# Altium schematic sheet tmtr_board_rev1_0.SchDoc: tmtr_board_rev1.sch
size 282 x 200 mm; Date: 12/27/2014 6:12:07 PM; SheetNumber: Sheet:
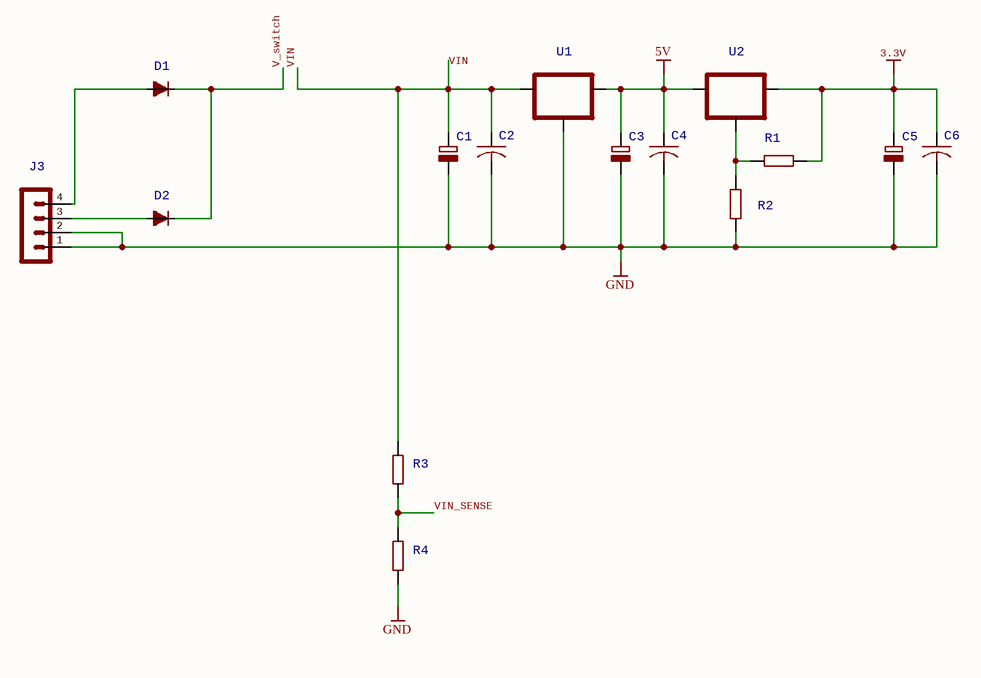
[diagram p0: tmtr_board_rev1_0.SchDoc]

## Parts
C1  <B>POLARIZED CAPACITOR</B>, European symbol  [153CLV-0810]  (value not drawn)
C2  <B>CAPACITOR</B>, American symbol  [C0805K]  (value not drawn)
C3  <B>POLARIZED CAPACITOR</B>, European symbol  [153CLV-0810]  (value not drawn)
C4  <B>CAPACITOR</B>, American symbol  [C0805K]  (value not drawn)
C5  <B>POLARIZED CAPACITOR</B>, European symbol  [153CLV-0810]  (value not drawn)
C6  <B>CAPACITOR</B>, American symbol  [C0805K]  (value not drawn)
D1  D-FILL-SMB  [SMB]  (value not drawn)
D2  D-FILL-SMB  [SMB]  (value not drawn)
J3  MA04-1  [MA04-1]  (value not drawn)
R1  R-EU_M0805  [M0805]  (value not drawn)
R2  R-EU_M0805  [M0805]  (value not drawn)
R3  R-EU_M0805  [M0805]  (value not drawn)
R4  R-EU_M0805  [M0805]  (value not drawn)
U1  78XXS  [78XXS]  (value not drawn)
U2  LD117A?*S  [SOT223]  (value not drawn)

## Nets
3.3V: C5.+ C6.1 R1.2 U2.4(OUT)
5V: C3.+ C4.1 U1.OUT U2.3(IN)
GND: C1.- C2.2 C3.- C4.2 C5.- C6.2 J3.1 J3.2 R2.2 R4.2 U1.GND
V_switch: D1.1(C) D2.1(C)
VIN: C1.+ C2.1 R3.1 U1.IN
VIN_SENSE: R3.2 R4.1
NetD1_2: D1.2(A) J3.4
NetD2_2: D2.2(A) J3.3
NetR1_1: R1.1 R2.1 U2.1(ADJ)

## Notes on the sheet
- 1
- 2
- 3
- 4
- 5
- 6
- A
- B
- C
- D

## Library data of the parts
C1 C3 C5 = CPOL-EU153CLV-0810: Value: 100uF
C2 C4 C6 = C-USC0805K: Value: 0.1uF
D1 D2 = D-FILL-SMB: <B>DIODE</B><p> / filled; Value: 1N4007
J3 = MA04-1: <b>PIN HEADER</b>
R1 = R-EU_M0805: <B>RESISTOR</B>, European symbol; Value: 200R
R2 = R-EU_M0805: <B>RESISTOR</B>, European symbol; Value: 330R
R3 = R-EU_M0805: <B>RESISTOR</B>, European symbol; Value: 4.7K
R4 = R-EU_M0805: <B>RESISTOR</B>, European symbol; Value: 1K
U1 = 78XXS: <b>VOLTAGE REGULATOR</b>; Value: LM7805
U2 = LD117A?*S: <b>Low drop fixed and adjustable positive voltage regulators</b> 1 A<p> / Source: http://www.st.com/stonline/products/literature/ds/7194/ld1117axx.pdf; Value: LM317